# Altium schematic sheet Ampli50g.SchDoc
size A3
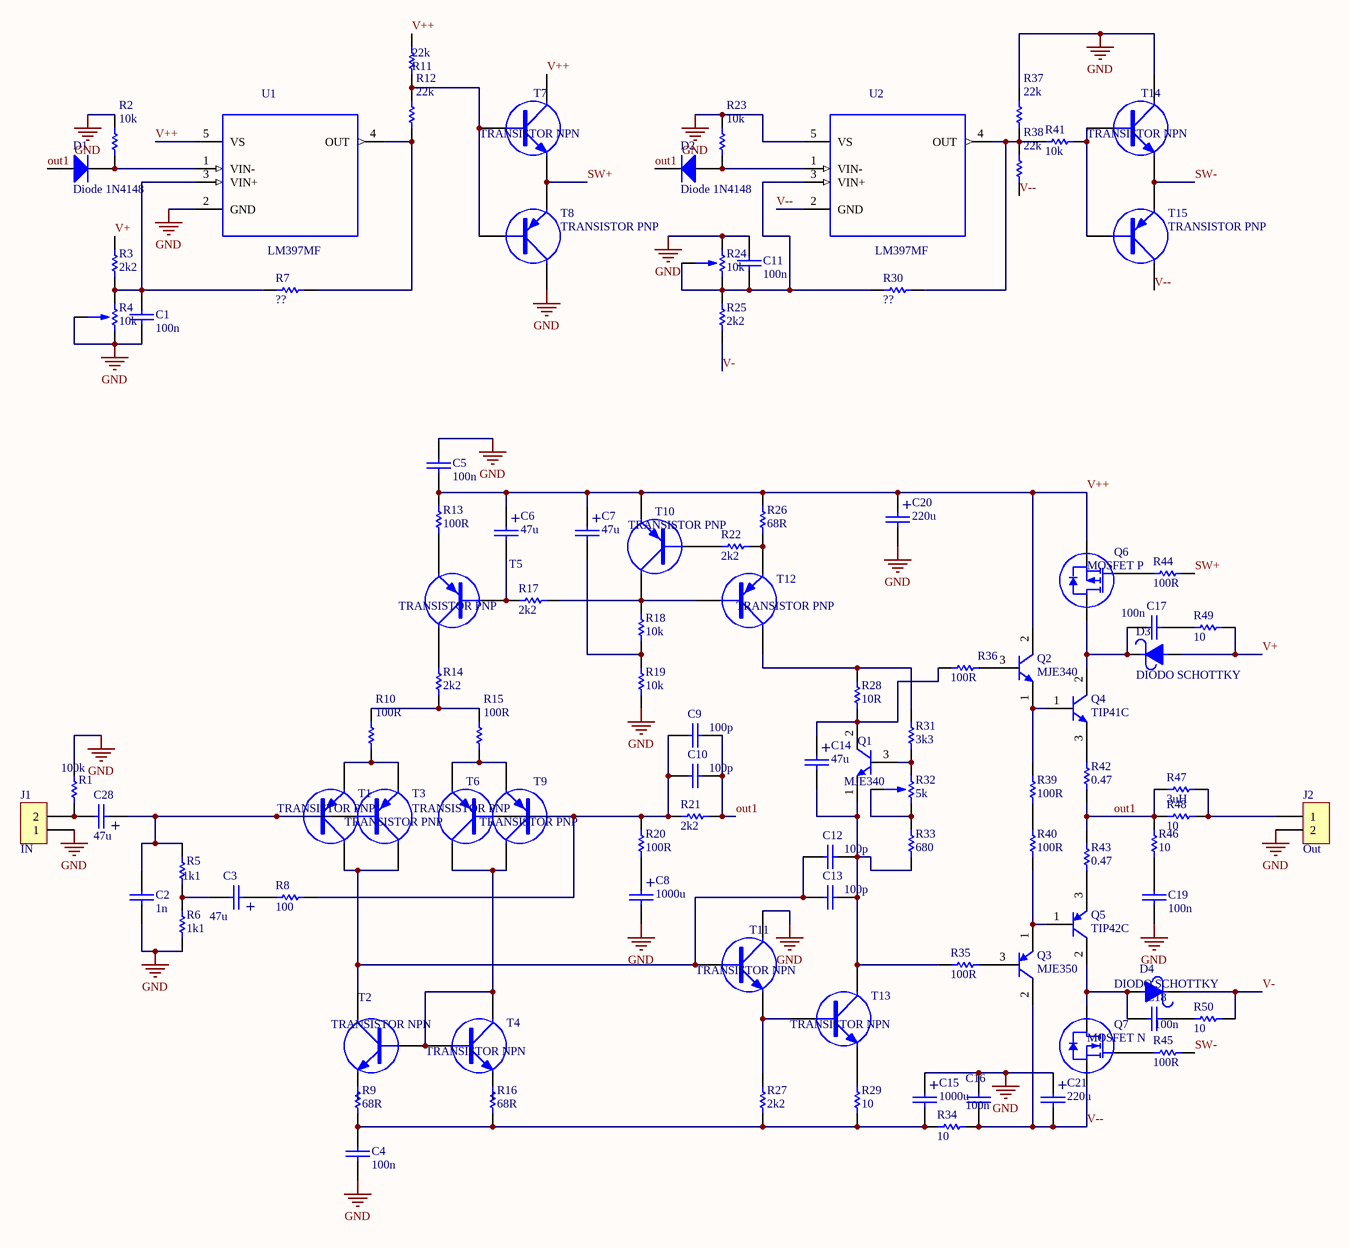
[diagram p0: Ampli50g.SchDoc]

## Parts
C1  100n  [0805]
C2  1n  [CAP200]
C3  47u  [CAP100RP]
C4  100n  [CAP200]
C5  100n  [CAP200]
C6  47u  [CAP100RP]
C7  47u  [CAP100RP]
C8  1000u  [CAP200RP2]
C9  100p  [0805]
C10  100p  [0805]
C11  100n  [0805]
C12  100p  [0805]
C13  100p  [0805]
C14  47u  [CAP100RP]
C15  1000u  [CAP200RP2]
C16  100n  [CAP200]
C17  100n  [CAP200]
C18  100n  [CAP200]
C19  100n  [CAP200]
C20  220u  [CAP200RP2]
C21  220u  [CAP200RP2]
C28  47u  [CAP100RP]
D1  Diode 1N4148  [DO-35]
D2  Diode 1N4148  [DO-35]
D3  DIODO SCHOTTKY  [SMCK]
D4  DIODO SCHOTTKY  [SMCK]
J1  IN  [BORNERA2]
J2  Out  [BORNERA2]
Q1  MJE340  [ONSC-TO-225-3-77-09]
Q2  MJE340  [ONSC-TO-225-3-77-09]
Q3  MJE350  [ONSC-TO-225-3-77-09]
Q4  TIP41C  [ONSC-TO-220-3-221A-09]
Q5  TIP42C  [ONSC-TO-220-3-221A-09]
Q6  MOSFET P  [TO-220 V]
Q7  MOSFET N  [TO-220 V]
R1  100k  [RES400]
R2  10k  [1206]
R3  2k2  [RES400]
R4  10k  [PRESET V]
R5  1k1  [1206]
R6  1k1  [1206]
R7  ??  [1206]
R8  100  [1206]
R9  68R  [1206]
R10  100R  [1206]
R11  22k  [1206]
R12  22k  [1206]
R13  100R  [1206]
R14  2k2  [1206]
R15  100R  [1206]
R16  68R  [1206]
R17  2k2  [1206]
R18  10k  [1206]
R19  10k  [1206]
R20  100R  [1206]
R21  2k2  [1206]
R22  2k2  [1206]
R23  10k  [1206]
R24  10k  [PRESET V]
R25  2k2  [RES400]
R26  68R  [1206]
R27  2k2  [1206]
R28  10R  [1206]
R29  10  [1206]
R30  ??  [1206]
R31  3k3  [1206]
R32  5k  [PRESET V]
R33  680  [1206]
R34  10  [RES500]
R35  100R  [1206]
R36  100R  [1206]
R37  22k  [1206]
R38  22k  [1206]
R39  100R  [RES500]
R40  100R  [RES500]
R41  10k  [1206]
R42  0.47  [RES1200]
R43  0.47  [RES1200]
R44  100R  [1206]
R45  100R  [1206]
R46  10  [RES600]
R47  3uH  [RES600]
R48  10  [RES600]
R49  10  [1206]
R50  10  [1206]
T1  TRANSISTOR PNP  [SOT23]
T2  TRANSISTOR NPN  [SOT23]
T3  TRANSISTOR PNP  [SOT23]
T4  TRANSISTOR NPN  [SOT23]
T5  TRANSISTOR PNP  [SOT23]
T6  TRANSISTOR PNP  [SOT23]
T7  TRANSISTOR NPN  [SOT23]
T8  TRANSISTOR PNP  [SOT23]
T9  TRANSISTOR PNP  [SOT23]
T10  TRANSISTOR PNP  [SOT23]
T11  TRANSISTOR NPN  [SOT23]
T12  TRANSISTOR PNP  [SOT23]
T13  TRANSISTOR NPN  [SOT23]
T14  TRANSISTOR NPN  [SOT23]
T15  TRANSISTOR PNP  [SOT23]
U1  LM397MF  [SOT95P285X120-5N]
U2  LM397MF  [SOT95P285X120-5N]

## Nets
GND: C1.1 C2.2 C4.2 C5.1 C8.2 C11.2 C15.1 C16.1 C19.2 C20.2 C21.1 J1.1 J2.2 R1.2 R2.2 R4.1 R4.2 R6.1 R19.2 R23.2 R24.3 R37.2 T8.2(C) T11.2(C) T14.2(C) U1.2(GND) U2.5(VS)
out1: C9.2 C10.2 D1.1(A) D2.2(K) R21.1 R42.1 R43.2 R46.2 R47.2 R48.2
SW+: R44.1 T7.3(E) T8.3(E)
SW-: R45.1 T14.3(E) T15.3(E)
V+: D3.1 R3.2 R49.2
V++: C5.2 C6.1 C7.1 C20.1 Q2.2(C) Q6.3(S) R11.2 R13.2 R26.2 T7.2(C) T10.3(E) U1.5(VS)
V-: D4.2 R25.1 R50.2
V--: C16.2 C21.2 Q3.2(C) Q7.3(S) R34.1 R38.1 T15.2(C) U2.2(GND)
NetC1_2: C1.2 R3.1 R4.3 R7.2 U1.3(VIN+)
NetC2_1: C2.1 C28.1 R5.2 T1.1(B) T3.1(B)
NetC3_1: C3.1 R8.2
NetC3_2: C3.2 R5.1 R6.2
NetC4_1: C4.1 C15.2 R9.1 R16.1 R27.2 R29.2 R34.2
NetC6_2: C6.2 R17.2 T5.1(B)
NetC7_2: C7.2 R18.2 R19.1
NetC8_1: C8.1 R20.1
NetC9_1: C9.1 C10.1 R8.1 R20.2 R21.2 T6.1(B) T9.1(B)
NetC11_1: C11.1 R24.1 R24.2 R25.2 R30.2 U2.3(VIN+)
NetC12_1: C12.1 C13.1 T1.2(C) T2.2(C) T3.2(C) T11.1(B)
NetC12_2: C12.2 C13.2 C14.2 Q1.1(E) R33.1 R35.2 T13.2(C)
NetC14_1: C14.1 Q1.2(C) R28.1 R36.2
NetC17_1: C17.1 D3.2 Q4.2(C) Q6.2(D)
NetC17_2: C17.2 R49.1
NetC18_1: C18.1 D4.1 Q5.2(C) Q7.2(D)
NetC18_2: C18.2 R50.1
NetC19_1: C19.1 R46.1
NetC28_2: C28.2 J1.2 R1.1
NetD1_2: D1.2(K) R2.1 U1.1(VIN-)
NetD2_1: D2.1(A) R23.1 U2.1(VIN-)
NetJ2_1: J2.1 R47.1 R48.1
NetQ1_3: Q1.3(B) R31.1 R32.3
NetQ2_1: Q2.1(E) Q4.1(B) R39.2
NetQ2_3: Q2.3(B) R36.1
NetQ3_1: Q3.1(E) Q5.1(B) R40.1
NetQ3_3: Q3.3(B) R35.1
NetQ4_3: Q4.3(E) R42.2
NetQ5_3: Q5.3(E) R43.1
NetQ6_1: Q6.1(G) R44.2
NetQ7_1: Q7.1(G) R45.2
NetR7_1: R7.1 R12.1 U1.4(OUT)
NetR10_1: R10.1 T1.3(E) T3.3(E)
NetR10_2: R10.2 R14.2 R15.2
NetR11_1: R11.1 R12.2 T7.1(B) T8.1(B)
NetR13_1: R13.1 T5.3(E)
NetR14_1: R14.1 T5.2(C)
NetR15_1: R15.1 T6.3(E) T9.3(E)
NetR17_1: R17.1 R18.1 T10.2(C) T12.1(B)
NetR22_1: R22.1 R26.1 T12.3(E)
NetR22_2: R22.2 T10.1(B)
NetR27_1: R27.1 T11.3(E) T13.1(B)
NetR28_2: R28.2 R31.2 T12.2(C)
NetR29_1: R29.1 T13.3(E)
NetR30_1: R30.1 R37.1 R38.2 R41.2 U2.4(OUT)
NetR32_1: R32.1 R32.2 R33.2
NetR39_1: R39.1 R40.2
NetR41_1: R41.1 T14.1(B) T15.1(B)
NetT2_1: T2.1(B) T4.1(B) T4.2(C) T6.2(C) T9.2(C)

Not connected (* = marked no-connect by the designer): R9 2; R16 2; T2 3(E); T4 3(E)

## Notes on the sheet
- (in symbol CAPPOL) +

## Library data of the parts
C1 C2 C4 C5 C9-C13 C16-C19 = CAP
C3 C6-C8 C14 C15 C20 C21 C28 = CAPPOL
D1 D2 = Diode 1N4148: High Conductance Fast Diode; Published: 8-Jun-2000; LatestRevisionDate: 17-Jul-2002; LatestRevisionNote: Re-released for DXP Platform.; DatasheetVersion: 1997; PackageReference: DO-35; Publisher: Altium Limited; PackageDescription: Diode, Axial; Body 3.8 x 1.9 mm (LxDia. max), Lead Dia. 0.53 mm (max); Code_JEDEC: DO-204-AH; ComponentLink1Description: Manufacturer Link; ComponentLink1URL: http://www.fairchildsemi.com/; ComponentLink2Description: Datasheet; ComponentLink2URL: http://www.fairchildsemi.com/ds/1N%2F1N4148.pdf
J1 J2 = BORNERA 2
Q1 Q2 = MJE340: Plastic Medium-Power NPN Silicon Transistor, 3-Pin TO-225, Bulk Box; Manufacturer: On Semiconductor; Note: 0; IC Continuous (A): 0.5; DatasheetVersion: Rev. 12; PackageVersion: Rev. AC, 12/2013; PackageReference: TO-225-3-77-09; PackageDescription: 3-Pin Flange Mount, Vertical Straight Lead, Body 7.6 x 2.7 mm, Pitch 2.29 mm; Packing: Bulk Box; Polarity: NPN; RoHS: FALSE; Mounting Technology: Through Hole; PartNumber: MJE340; ComponentLink1Description: Manufacturer URL; ComponentLink1URL: http://www.onsemi.com/; ComponentLink2Description: Datasheet; ComponentLink2URL: http://www.onsemi.com/pub_link/Collateral/MJE340-D.PDF; ComponentLink3Description: Package Specification; ComponentLink3URL: http://www.onsemi.com/pub_link/Collateral/77-09.PDF
Q3 = MJE350: Plastic Medium-Power PNP Silicon Transistor, 3-Pin TO-225, Bulk Box; Manufacturer: On Semiconductor; Note: 0; IC Continuous (A): 0.5; DatasheetVersion: Rev. 16; PackageVersion: Rev. AC, 12/2013; PackageReference: TO-225-3-77-09; PackageDescription: 3-Pin Flange Mount, Vertical Straight Lead, Body 7.6 x 2.7 mm, Pitch 2.29 mm; Packing: Bulk Box; Polarity: PNP; RoHS: FALSE; Mounting Technology: Through Hole; PartNumber: MJE350; ComponentLink1Description: Manufacturer URL; ComponentLink1URL: http://www.onsemi.com/; ComponentLink2Description: Datasheet; ComponentLink2URL: http://www.onsemi.com/pub_link/Collateral/MJE350-D.PDF; ComponentLink3Description: Package Specification; ComponentLink3URL: http://www.onsemi.com/pub_link/Collateral/77-09.PDF
Q4 = TIP41C: Complementary Silicon Plastic Power Transistor, 3-Pin TO-220, Tube; Manufacturer: On Semiconductor; fT Min (MHz): 3; IC Continuous (A): 6; Polarity: NPN; DatasheetVersion: Rev. 10; PackageVersion: Rev. AG, 09/2011; PackageReference: TO-220-3-221A-09; PackageDescription: 3-Pin Flange Mount, Vertical Straight Lead, Body 9.97 x 4.445 mm, Pitch 2.54 mm; Supplier 1: Digi-Key; Supplier Part Number 1: TIP41COS-ND; Packing: Tube; RoHS: FALSE; Mounting Technology: Through Hole; PartNumber: TIP41C; ComponentLink1Description: Manufacturer URL; ComponentLink1URL: http://www.onsemi.com/; ComponentLink2Description: Datasheet; ComponentLink2URL: http://www.onsemi.com/pub_link/Collateral/TIP41A-D.PDF; ComponentLink3Description: Package Specification; ComponentLink3URL: http://www.onsemi.com/pub_link/Collateral/221A-09.PDF
Q5 = TIP42C: Complementary Silicon Plastic Power Transistor, 3-Pin TO-220, Tube; Manufacturer: On Semiconductor; fT Min (MHz): 3; IC Continuous (A): 6; Polarity: PNP; DatasheetVersion: Rev. 10; PackageVersion: Rev. AG, 09/2011; PackageReference: TO-220-3-221A-09; PackageDescription: 3-Pin Flange Mount, Vertical Straight Lead, Body 9.97 x 4.445 mm, Pitch 2.54 mm; Supplier 1: Digi-Key; Supplier Part Number 1: TIP42COS-ND; Packing: Tube; RoHS: FALSE; Mounting Technology: Through Hole; PartNumber: TIP42C; ComponentLink1Description: Manufacturer URL; ComponentLink1URL: http://www.onsemi.com/; ComponentLink2Description: Datasheet; ComponentLink2URL: http://www.onsemi.com/pub_link/Collateral/TIP41A-D.PDF; ComponentLink3Description: Package Specification; ComponentLink3URL: http://www.onsemi.com/pub_link/Collateral/221A-09.PDF
R1-R3 R5 R6 R8-R10 R13 R14 R16-R23 R25-R29 R31 R33-R36 R39 R40 R42-R50 = RES
R4 R24 R32 = PRESET
R7 R11 R12 R15 R30 R37 R38 R41 = RES: RES SMD 1/2W 1206
U1 U2 = LM397MF: General Purpose Comparator, Single, 250ns, Sot23-5, Full Reel; MP: LM397MF/NOPB; MF: Texas Instruments; Package: SOT-23 Texas Instruments; Digi-Key_Purchase_URL: https://www.digikey.com.ar/product-detail/en/texas-instruments/LM397MF-NOPB/LM397MF-NOPBCT-ND/2469089?utm_source=snapeda&utm_medium=aggregator&utm_campaign=symbol; SnapEDA_Link: https://www.snapeda.com/parts/LM397MF/NOPB/Texas%20Instruments/view-part/?ref=snap; Digi-Key_Part_Number: LM397MF/NOPBCT-ND; Value: *